# EAGLE design vumeter-LM3915 (EAGLE 7.2.0)
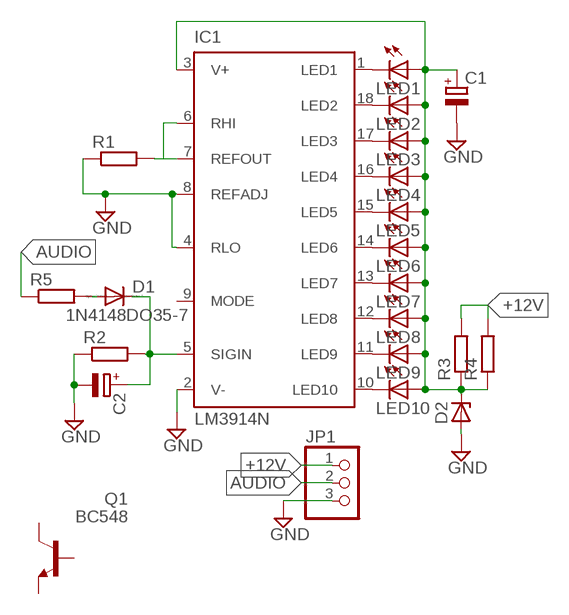
[diagram p0: schematic, sheet 1]

## Parts
C1  CPOL-EUE2-4  [E2-4]
C2  CPOL-EUE2-4  [E2-4]
D1  1N4148DO35-7  [DO35-7]
D2  ZENER-DIODEZD-10  [ZDIO-10]
IC1  LM3914N  [DIL18]
JP1  PINHD-1X3  [1X03]
LED1  LED3MM  [LED3MM]
LED2  LED3MM  [LED3MM]
LED3  LED3MM  [LED3MM]
LED4  LED3MM  [LED3MM]
LED5  LED3MM  [LED3MM]
LED6  LED3MM  [LED3MM]
LED7  LED3MM  [LED3MM]
LED8  LED3MM  [LED3MM]
LED9  LED3MM  [LED3MM]
LED10  LED3MM  [LED3MM]
Q1  BC548  [TO92-EBC]
R1  R-EU_0207/7  [0207/7]
R2  R-EU_0207/7  [0207/7]
R3  R-EU_0207/7  [0207/7]
R4  R-EU_0207/7  [0207/7]
R5  R-EU_0207/7  [0207/7]

## Nets
+12V: JP1.1 R3.2 R4.2
AUDIO: JP1.2 R5.1
GND: C1.- C2.- D2.A IC1.2(V-) IC1.4(RLO) IC1.8(REFADJ) JP1.3 R1.1 R2.1
N$1: IC1.1(LED1) LED1.K(C)
N$2: IC1.18(LED2) LED2.K(C)
N$3: IC1.17(LED3) LED3.K(C)
N$4: IC1.16(LED4) LED4.K(C)
N$5: IC1.15(LED5) LED5.K(C)
N$6: IC1.14(LED6) LED6.K(C)
N$7: IC1.13(LED7) LED7.K(C)
N$8: IC1.11(LED9) LED9.K(C)
N$9: IC1.10(LED10) LED10.K(C)
N$10: IC1.6(RHI) IC1.7(REFOUT) R1.2
N$11: C2.+ D1.C IC1.5(SIGIN) R2.2
N$12: D1.A R5.2
N$13: C1.+ D2.C IC1.3(V+) LED1.A LED2.A LED3.A LED4.A LED5.A LED6.A LED7.A LED8.A LED9.A LED10.A R3.1 R4.1
N$14: IC1.12(LED8) LED8.K(C)
Unconnected: IC1.9(MODE) Q1.B Q1.C Q1.E

## Library data of the parts
C1 C2 = rcl:CPOL-EU: POLARIZED CAPACITOR, European symbol
D1 = diode:1N4148: DIODE high speed (Philips)
D2 = diode:ZENER-DIODE: Z-Diode
IC1 = national-semiconductor:LM391: Dot/Bar Display Driver Source: Data sheet LM3915 <http://www.national.com/ds/LM/LM3915.pdf> Data sheet LM3914 <http://www.national.com/ds/LM/LM3914.pdf>
JP1 = pinhead:PINHD-1X3: PIN HEADER
LED1-LED10 = led:LED: LED OSRAM: - CHIPLED LG R971, LG N971, LY N971, LG Q971, LY Q971, LO R971, LY R971 LH N974, LH R974 LS Q976, LO Q976, LY Q976 LO Q996 - Hyper CHIPLED LW Q18S LB Q993, LB Q99A, LB R99A - SideLED LS A670, LO A670, LY A670, LG A670, LP A670 LB A673, LV A673, LT A673, LW A673 LH A674 LY A675 LS A676, LA A676, LO A676, LY A676, LW A676 LS A679, LY A679, LG A679 - Hyper Micro SIDELED® LS Y876, LA Y876, LO Y876, LY Y876 LT Y87S - SmartLED LW L88C, LW L88S LB L89C, LB L89S, LG L890 LS L89K, LO L89K, LY L89K LS L896, LA L896, LO L896, LY L896 - TOPLED LS T670, LO T670, LY T670, LG T670, LP T670 LSG T670, LSP T670, LSY T670, LOP T670, LYG T670 LG T671, LOG T671, LSG T671 LB T673, LV T673, LT T673, LW T673 LH T674 LS T676, LA T676, LO T676, LY T676, LB T676, LH T676, LSB T676, LW T676 LB T67C, LV T67C, LT T67C, LS T67K, LO T67K, LY T67K, LW E67C LS E67B, LA E67B, LO E67B, LY E67B, LB E67C, LV E67C, LT E67C LW T67C LS T679, LY T679, LG T679 LS T770, LO T770, LY T770, LG T770, LP T770 LB T773, LV T773, LT T773, LW T773 LH T774 LS E675, LA E675, LY E675, LS T675 LS T776, LA T776, LO T776, LY T776, LB T776 LHGB T686 LT T68C, LB T68C - Hyper Mini TOPLED® LB M676 - Mini TOPLED Santana® LG M470 LS M47K, LO M47K, LY M47K Source: http://www.osram.convergy.de LUXEON: - LUMILED® LXK2-PW12-R00, LXK2-PW12-S00, LXK2-PW14-U00, LXK2-PW14-V00 LXK2-PM12-R00, LXK2-PM12-S00, LXK2-PM14-U00 LXK2-PE12-Q00, LXK2-PE12-R00, LXK2-PE12-S00, LXK2-PE14-T00, LXK2-PE14-U00 LXK2-PB12-K00, LXK2-PB12-L00, LXK2-PB12-M00, LXK2-PB14-N00, LXK2-PB14-P00, LXK2-PB14-Q00 LXK2-PR12-L00, LXK2-PR12-M00, LXK2-PR14-Q00, LXK2-PR14-R00 LXK2-PD12-Q00, LXK2-PD12-R00, LXK2-PD12-S00 LXK2-PH12-R00, LXK2-PH12-S00 LXK2-PL12-P00, LXK2-PL12-Q00, LXK2-PL12-R00 Source: www.luxeon.com KINGBRIGHT: KA-3528ASYC Source: www.kingbright.com
Q1 = transistor-npn:BC548*: NPN Transistor
R1-R5 = resistor:R-EU_: RESISTOR, European symbol

## Board
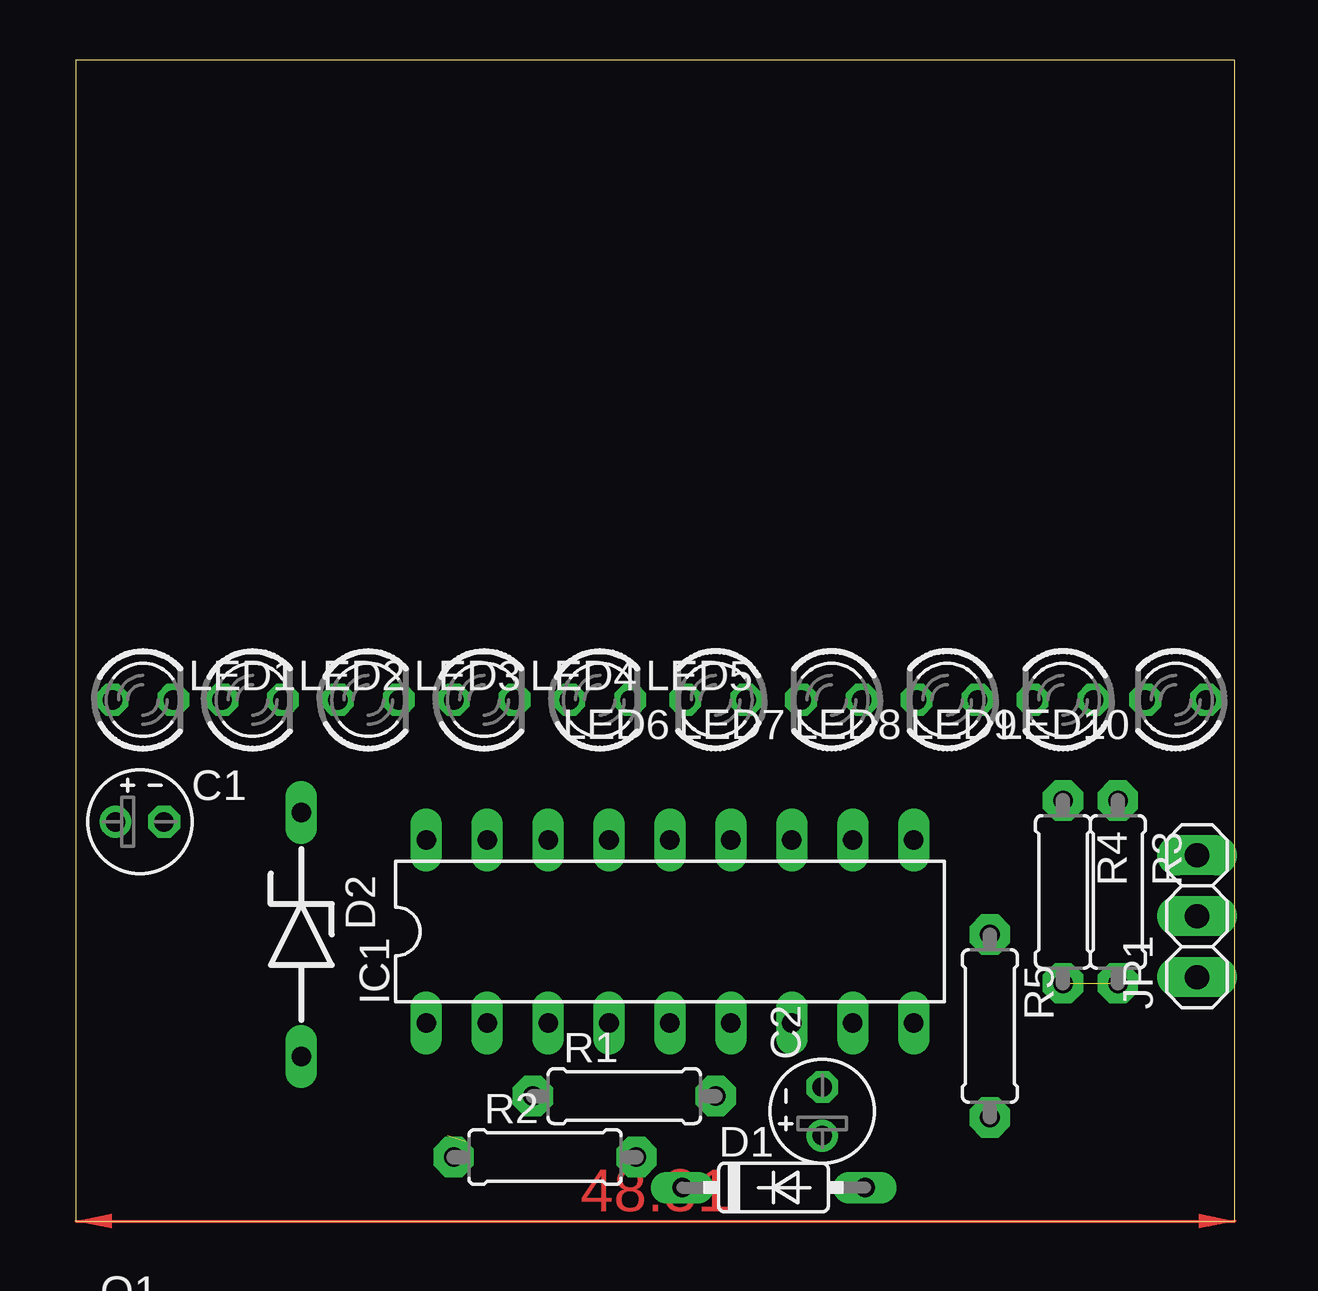
[diagram p1: board, top side]
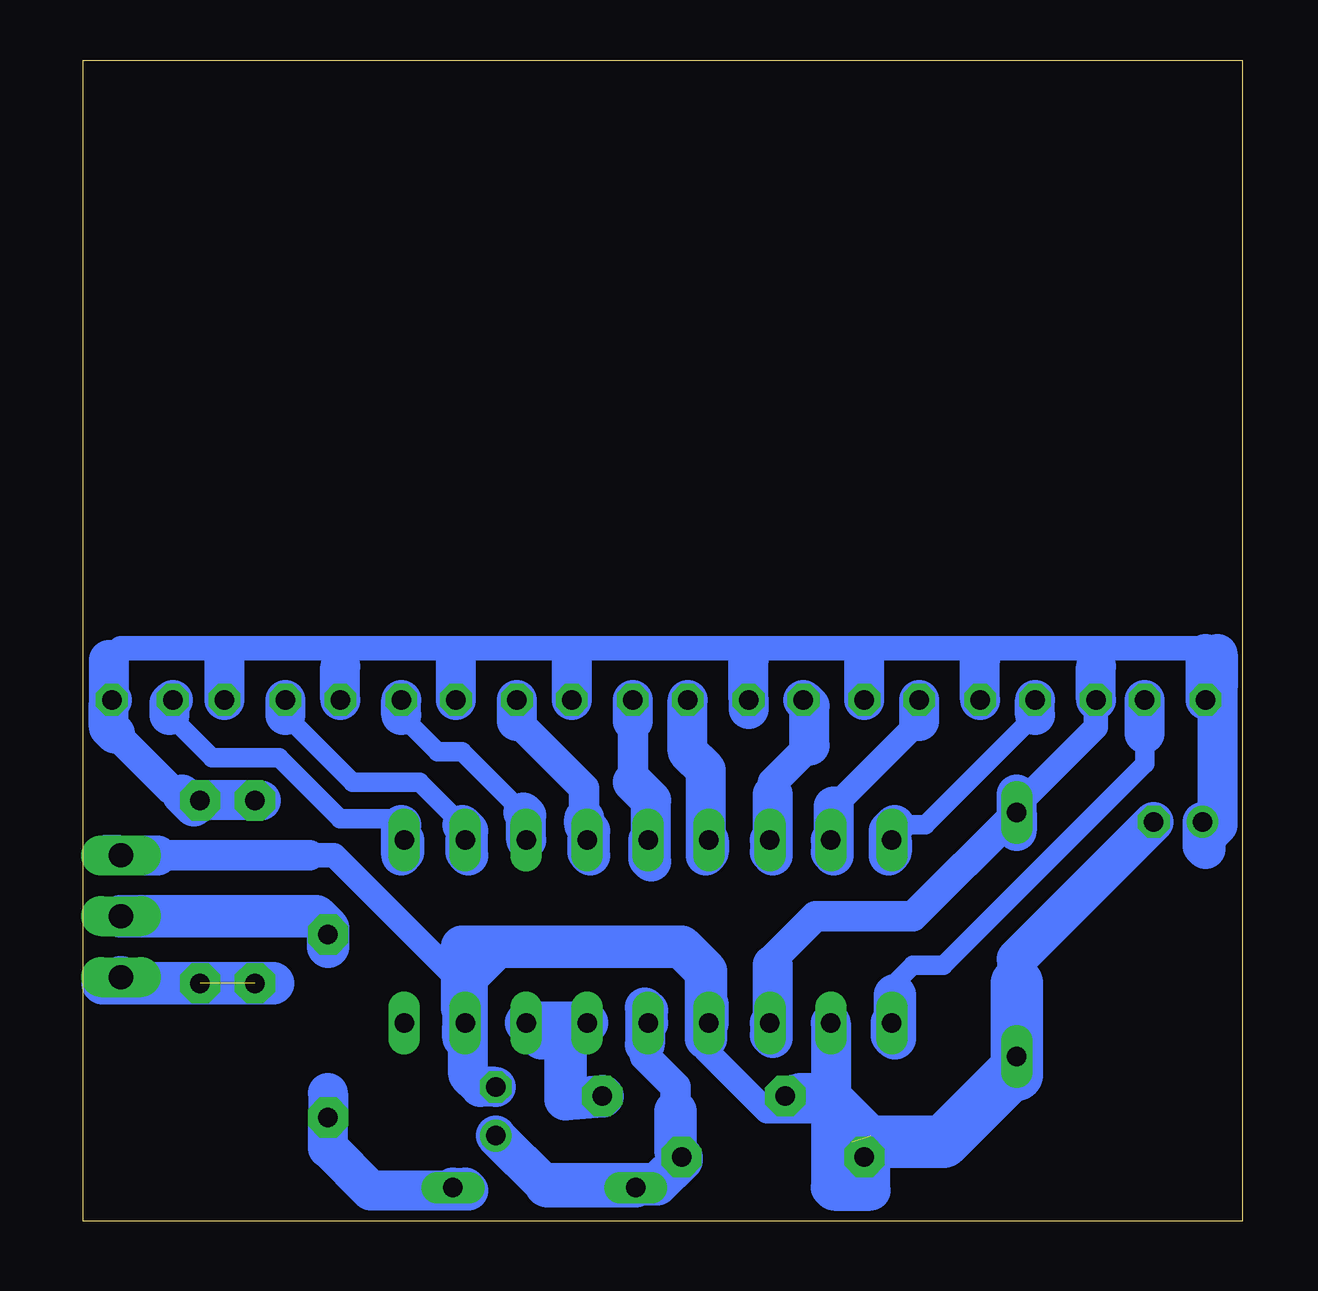
[diagram p2: board, bottom side, seen from below]

Size 48.31 x 48.38 mm. Coordinates in mm from the lower left corner, seen from the top.
Outline: 0,0 48.31,0 48.31,48.38 0,48.38 0,0
Copper layers (1*16): Top 0.035mm / dielectric 1.5mm / Bottom 0.035mm
Design rules "default": minimum track width 10mil, minimum drill 24mil, track to track 8mil, track to pad 8mil, pad to pad 8mil, via to via 8mil, smd to smd 8mil, copper to edge 40mil, drill to drill 8mil, minimum pad ring 10mil, minimum via ring 8mil, stop-mask expansion 4mil, vias tented up to drill 0mil, thermal gap 10mil

### Footprints (pad centres in the part's own frame; a part is rotated, then mirrored left to right if it is on the bottom)
E2-4 = drill 0.813 pad 1.27: + -1.016,0 | drill 0.813 pad 1.27 octagon: - 1.016,0
DO35-7 = drill 0.813 long: A 3.81,0; C -3.81,0
ZDIO-10 = drill 0.813 long: A 5.08,0; C -5.08,0
DIL18 = drill 0.813 long: 1 -10.16,-3.81; 2 -7.62,-3.81; 3 -5.08,-3.81; 4 -2.54,-3.81; 5 0,-3.81; 6 2.54,-3.81; 7 5.08,-3.81; 8 7.62,-3.81; 9 10.16,-3.81; 10 10.16,3.81; 11 7.62,3.81; 12 5.08,3.81; 13 2.54,3.81; 14 0,3.81; 15 -2.54,3.81; 16 -5.08,3.81; 17 -7.62,3.81; 18 -10.16,3.81
1X03 = drill 1.016 pad 1.676 long: 1 -2.54,0; 2 0,0; 3 2.54,0
LED3MM = drill 0.813 octagon: A -1.27,0; K 1.27,0
TO92-EBC = drill 0.813 long: B 0,-1.27; C -2.54,-1.27; E 2.54,-1.27
0207/7 = drill 0.813 pad 1.676 octagon: 1 -3.81,0; 2 3.81,0

### Placement (x,y rotation side)
C1  2.67,16.64 0 top
C2  31.11,4.57 90 top
D1  29.08,1.4 0 top
D2  9.4,11.94 270 top
IC1  24.77,12.06 0 top
JP1  46.74,12.7 90 top
LED1  2.79,21.72 0 top
LED2  7.37,21.72 0 top
LED3  12.19,21.72 0 top
LED4  17.02,21.72 0 top
LED5  21.84,21.72 0 top
LED6  26.67,21.72 180 top
LED7  31.5,21.72 180 top
LED8  36.32,21.72 180 top
LED9  41.15,21.72 180 top
LED10  45.85,21.72 180 top
Q1  3.56,-5.33 0 top  (outside the outline)
R1  22.86,5.21 0 top
R2  19.56,2.67 0 top
R3  43.43,13.72 270 top
R4  41.15,13.72 270 top
R5  38.1,8.13 270 top

### Tracks (layer width: path | path; a pad name or v marks a point on that pad's centre or on a via)
+12V  (1 unrouted)
  Bottom 1.778: R4.2 47.5,9.91 | R4.2 40.39,9.91 | R4.2 46.48,9.91 JP1.1
AUDIO
  Bottom 1.778: 38.1,11.43 R5.1 38.1,12.19 38.61,12.7 JP1.2
GND  (1 unrouted)
  Bottom 1.016: 22.35,7.62 22.35,7.11 19.81,4.57 17.4,4.57 17.14,4.32 | 38.86,15.24 37.85,15.24 32.51,9.91
  Bottom 1.27: 45.21,15.24 38.86,15.24
  Bottom 1.676: IC1.2 17.14,4.32 17.14,1.4 17.02,1.27 15.49,1.27 15.49,3.56 17.27,5.33 18.41,5.33 R1.1 | IC1.4 22.23,9.02 22.35,9.14 22.35,7.62 | 47.5,15.24 JP1.3 45.21,15.24 | 32.51,9.91 32.51,8.89 32.51,8.13 | 32.51,7.62 32.51,8.13 | 32.51,8.13 IC1.8 | C2.- 31.75,5.59 32.26,6.1 32.26,10.16 30.99,11.43 | C1.- 9.4,10.92 9.4,9.91
  Bottom 1.778: 22.35,7.62 22.35,10.41 23.37,11.43 30.99,11.43 32.51,11.43 32.51,8.89
  Bottom 2.184: 9.4,9.91 D2.A 9.4,6.1 9.65,6.1 12.45,3.3 16.26,3.3 16.26,3.17 R2.1
N$1
  Bottom 0.813: 14.48,9.4 14.48,9.91 13.72,10.67 12.45,10.67 4.06,19.05 4.06,20.07
  Bottom 1.016: 4.06,20.07 4.06,20.32
  Bottom 1.676: 4.06,20.32 LED1.K
  Bottom 1.778: IC1.1 14.61,7.75 14.48,7.62 14.48,9.4
N$2
  Bottom 0.813: 14.48,16.51 13.21,16.51 8.64,21.08
  Bottom 1.676: IC1.18 14.61,15.37 14.73,15.24 14.73,16.26 14.48,16.51 | 8.64,21.08 LED2.K
N$3
  Bottom 1.016: 17.02,17.27 13.46,20.83
  Bottom 1.676: IC1.17 17.14,15.37 17.02,15.24 17.02,17.27 | 13.46,20.83 LED3.K
N$4
  Bottom 1.27: 19.56,17.78 19.56,18.29 18.03,19.81
  Bottom 1.676: IC1.16 19.68,15.37 19.56,15.24 19.56,17.78 | 18.03,19.81 18.03,21.46 LED4.K
N$5
  Bottom 1.676: IC1.15 22.23,15.37 22.35,15.24 22.35,18.8 23.11,19.56 LED5.K
N$6
  Bottom 1.27: 25.4,18.29 25.4,20.83
  Bottom 1.676: IC1.14 24.77,15.11 24.64,14.99 24.64,17.53 25.4,18.29 | 25.4,20.83 LED6.K
N$7
  Bottom 1.27: 27.43,16.76 27.43,18.03 30.23,20.83
  Bottom 1.676: IC1.13 27.3,15.37 27.18,15.24 27.18,16.26 27.43,16.51 27.43,16.76 | 30.23,20.83 LED7.K
N$8
  Bottom 0.813: 32.51,16.51 34.29,18.29 37.08,18.29 39.88,21.08
  Bottom 1.676: IC1.11 32.38,15.37 32.26,15.24 32.26,16.26 32.51,16.51 | 39.88,21.08 LED9.K
N$9
  Bottom 0.813: 35.05,16.51 35.31,16.76 37.59,16.76 40.13,19.3 42.93,19.3 44.7,21.08
  Bottom 1.676: IC1.10 34.92,15.37 35.05,15.24 35.05,16.51 | 44.7,21.08 44.7,21.59 LED10.K
N$10
  Bottom 1.778: IC1.6 IC1.7 29.21,7.62 28.19,7.62 28.19,5.08 R1.2
N$11
  Bottom 1.27: 24.89,7.37 24.89,6.86 23.62,5.59 23.62,4.57
  Bottom 1.676: D1.C 28.96,1.4 29.02,1.46 C2.+ | IC1.5 24.77,8.76 24.89,8.89 24.89,7.37
  Bottom 1.778: 23.62,4.57 23.62,2.92 R2.2 23.37,2.54 24.38,1.52 28.96,1.52 29.02,1.46
N$12
  Bottom 1.676: D1.A 32.38,1.4 32.26,1.27 36.32,1.27 38.1,3.05 R5.2 38.1,5.33
N$13
  Bottom 1.016: 42.42,23.37 42.42,23.88 | 42.42,23.88 46.74,23.88 47.24,23.37 | 1.52,23.62 1.52,23.88 5.59,23.88 | 5.59,23.88 11.18,23.88 | 11.18,23.88 15.75,23.88 | 15.75,23.88 20.83,23.88 | 20.83,23.88 27.69,23.88 | 27.69,23.88 33.02,23.88 | 33.02,23.88 37.34,23.88 | 37.34,23.88 42.42,23.88 | 37.59,23.11 37.59,23.62 37.34,23.88 | 6.1,23.11 6.1,23.37 5.59,23.88 | 10.92,23.37 10.92,23.62 11.18,23.88 | 9.4,17.78 8.89,17.78 6.1,20.57 LED2.A | 32.77,23.37 32.77,23.62 33.02,23.88 | 15.75,23.37 15.75,23.88 | 20.57,23.37 20.57,23.62 20.83,23.88 | 27.94,23.37 27.94,23.62 27.69,23.88
  Bottom 1.27: 44.2,17.78 44.7,18.03 46.99,20.32 | 19.56,10.67 19.56,10.92 17.78,12.7 13.72,12.7 D2.C
  Bottom 1.676: 40.89,17.53 R4.1 R3.1 43.69,17.27 44.2,17.78 | 46.99,20.32 47.24,20.57 47.24,21.59 LED10.A 47.24,21.84 47.24,23.37 | LED9.A 42.42,23.37 | 1.52,23.62 LED1.A 1.02,22.23 | LED8.A 37.59,23.11 | LED2.A 6.1,23.11 | LED3.A 10.92,23.37 | 9.4,16.26 D2.C 9.4,17.78 | IC1.3 19.68,7.75 19.56,7.62 19.56,10.67 | LED7.A 32.77,23.37 | LED4.A 15.75,23.37 | 20.57,21.34 LED5.A 20.57,23.37 | LED6.A 27.94,23.37 | C1.+ 1.65,15.62 1.52,15.49 1.52,16 1.02,16.51 1.02,22.23 | 1.02,23.62 1.02,22.23
N$14
  Bottom 0.813: 29.97,17.02 32.51,19.56 33.53,19.56 35.05,21.08
  Bottom 1.676: IC1.12 29.84,16.89 29.97,17.02 | 35.05,21.08 LED8.K
(copper drawn outside any net)
  shapes: Top area x1